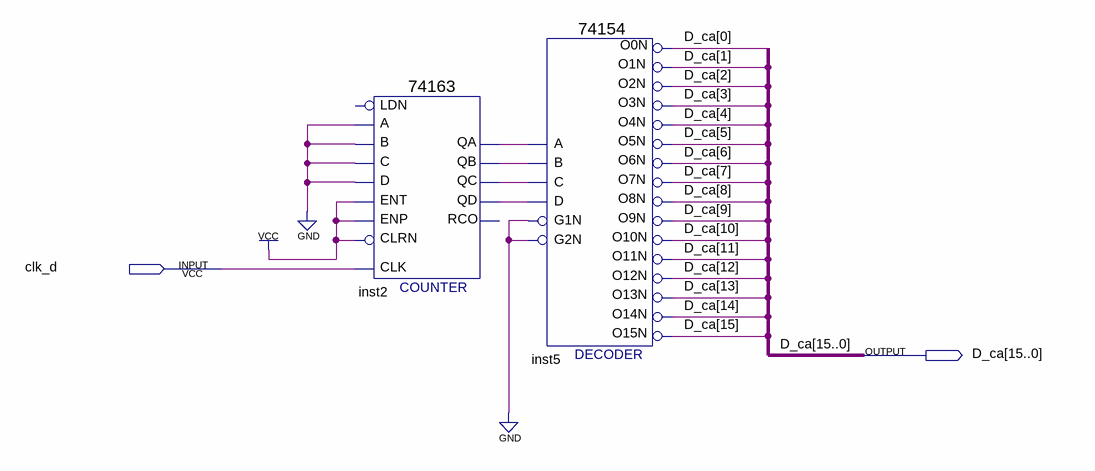
[diagram p0: schematic sheet]
// Quartus schematic Block1_3.bdf as structural Verilog: 2 symbols, 2 pins
module Block1_3 (
  input  clk_d,
  output [15:0] D_ca
);

  wire inst2_qa, inst2_qb, inst2_qc, inst2_qd;

  \74163  inst2 (
    .C(1'b0), .B(1'b0), .A(1'b0), .ENT(1'b1), .D(1'b0), .CLRN(1'b1), .CLK(clk_d), .ENP(1'b1), .QA(inst2_qa),
    .QB(inst2_qb), .QC(inst2_qc), .QD(inst2_qd));  // open: LDN, RCO
  \74154  inst5 (
    .C(inst2_qc), .D(inst2_qd), .B(inst2_qb), .A(inst2_qa), .G1N(1'b0), .G2N(1'b0), .O0N(D_ca[0]),
    .O12N(D_ca[12]), .O15N(D_ca[15]), .O10N(D_ca[10]), .O11N(D_ca[11]), .O1N(D_ca[1]), .O13N(D_ca[13]),
    .O14N(D_ca[14]), .O4N(D_ca[4]), .O3N(D_ca[3]), .O2N(D_ca[2]), .O7N(D_ca[7]), .O6N(D_ca[6]),
    .O5N(D_ca[5]), .O9N(D_ca[9]), .O8N(D_ca[8]));
endmodule
